# Altium schematic sheet 32x35雷达微动一体板V0.6.schdoc
size A3
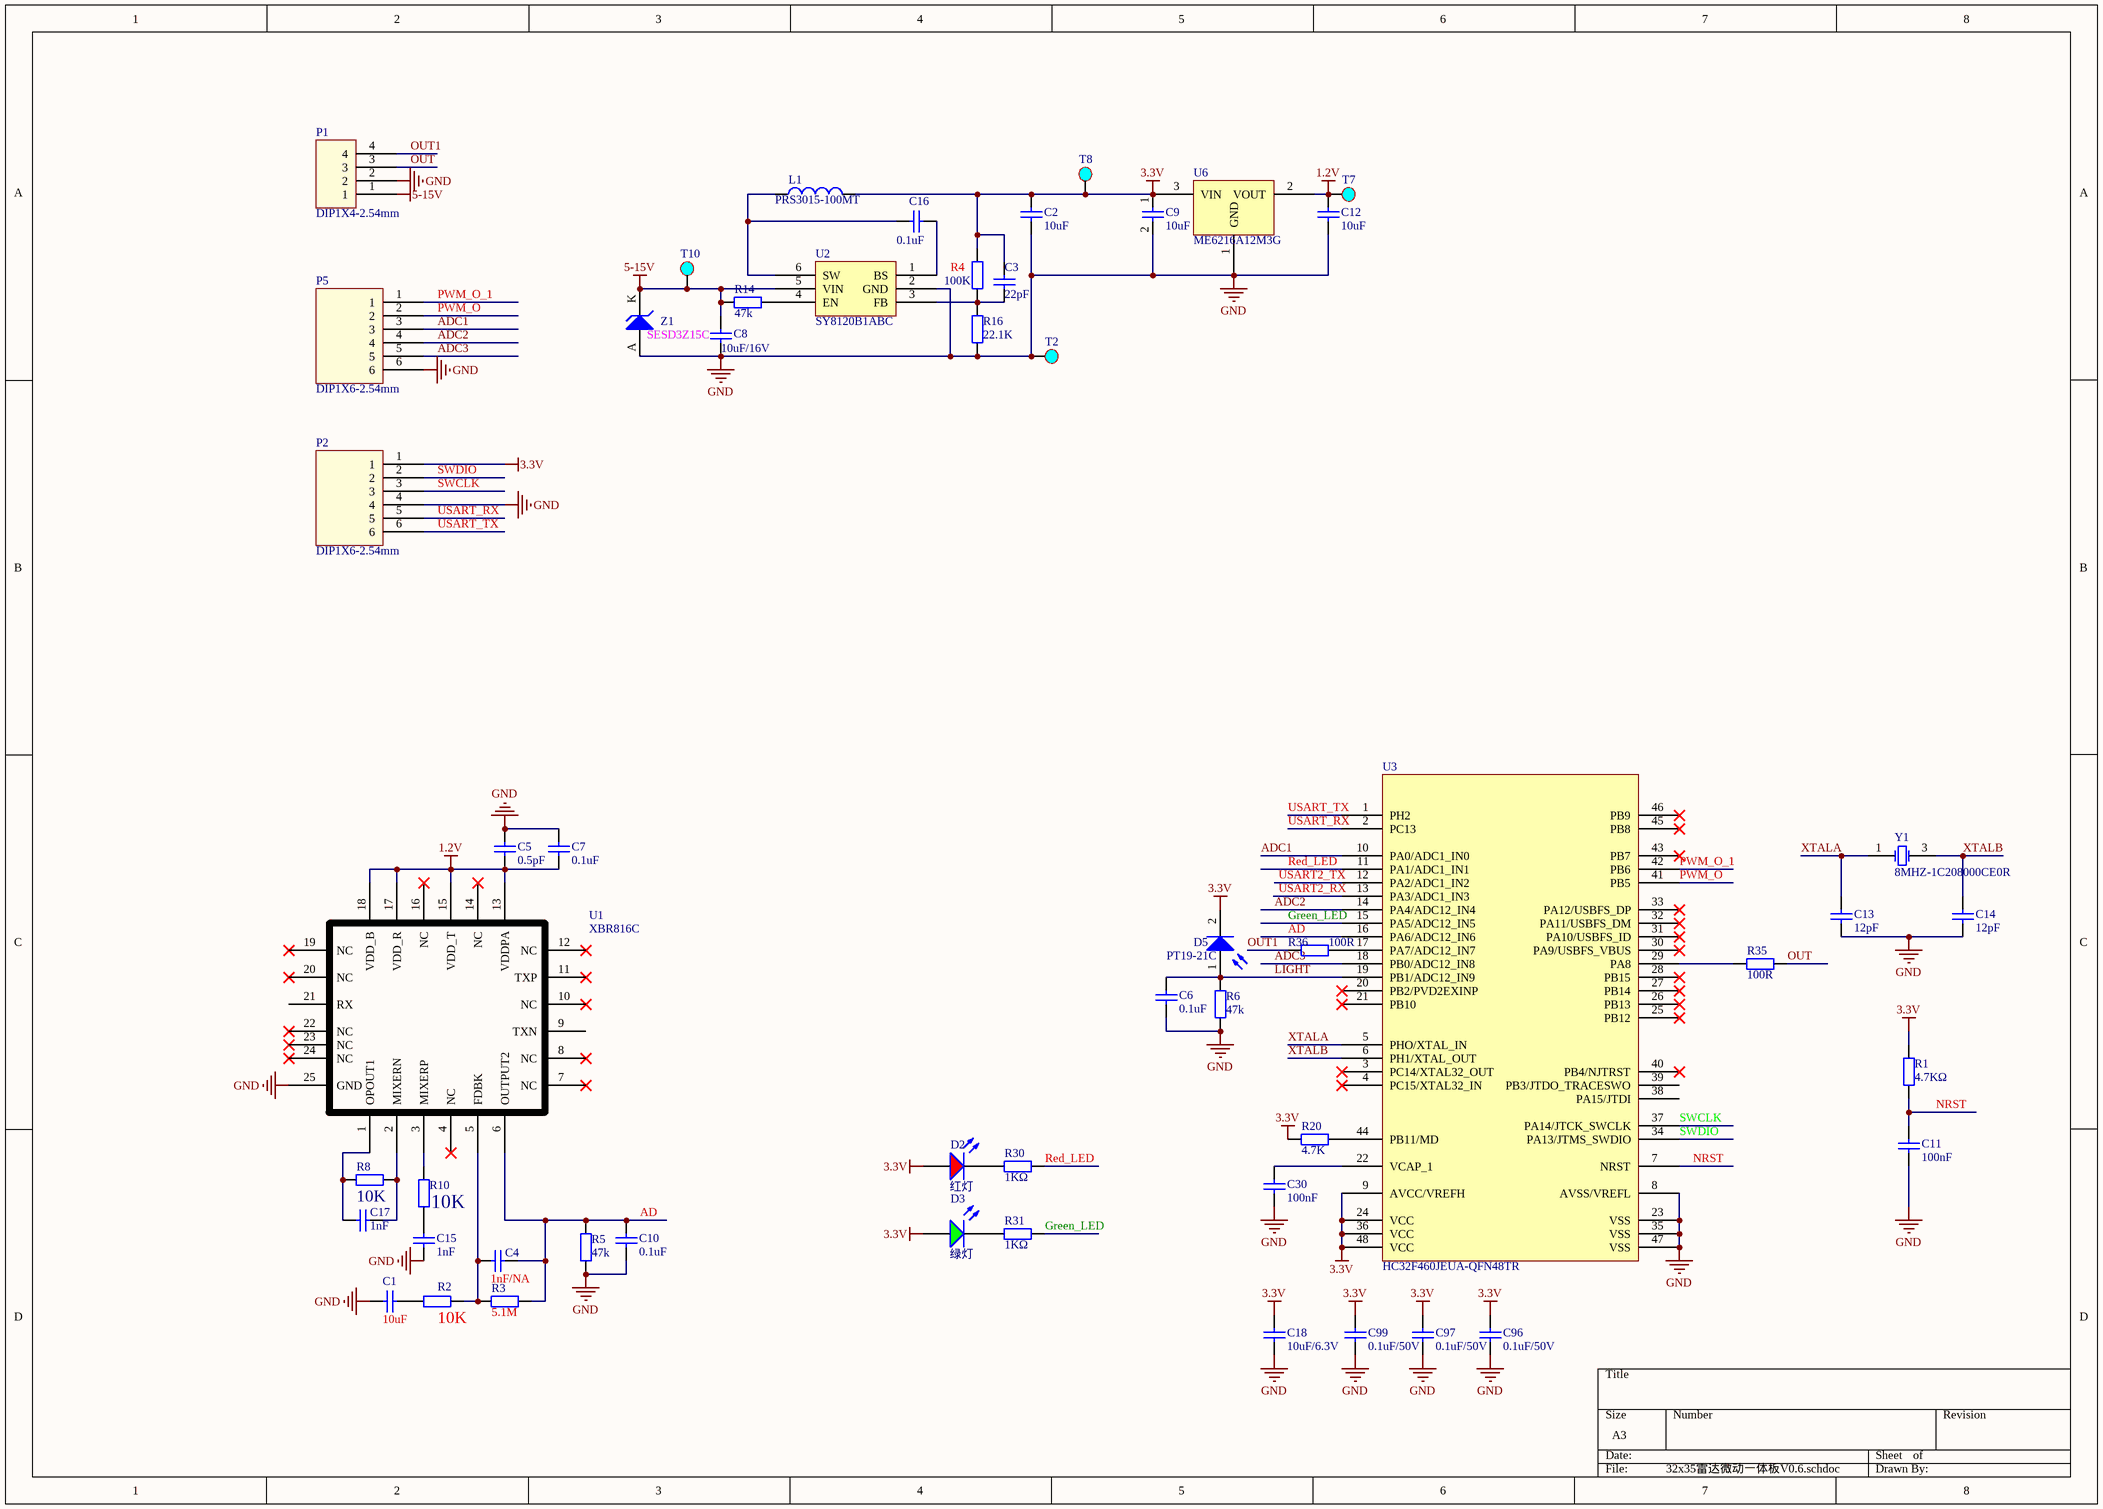
[diagram p0: 32x35雷达微动一体板V0.6.schdoc]

## Parts
C1  10uF  [C0402]
C2  10uF  [C0402]
C3  22pF  [C0402]
C4  1nF/NA  [C0402]
C5  0.5pF  [C0402]
C6  0.1uF  [C0402]
C7  0.1uF  [C0402]
C8  10uF/16V  [C0603]
C9  10uF  [C0402]
C10  0.1uF  [C0402]
C11  100nF  [C0402]
C12  10uF  [C0402]
C13  12pF  [C0402]
C14  12pF  [C0402]
C15  1nF  [C0402]
C16  0.1uF  [C0402]
C17  1nF  [C0402]
C18  10uF/6.3V  [C0402]
C30  100nF  [C0402]
C96  0.1uF/50V  [C0402]
C97  0.1uF/50V  [C0402]
C99  0.1uF/50V  [C0402]
D2  红灯  [LC-0603_LED_S1]
D3  绿灯  [LC-0603_LED_S1]
D5  PT19-21C  [LED-0603]
L1  PRS3015-100MT  [PRS3015]
P1  DIP1X4-2.54mm  [DIP1X4-2.54mm]
P2  DIP1X6-2.54mm  [DIP1X6-2.54]
P5  DIP1X6-2.54mm  [DIP1X6-2.54]
R1  4.7KΩ  [R0402]
R2  10K  [R0402]
R3  5.1M  [R0402]
R4  100K  [R0402]
R5  47k  [R0402]
R6  47k  [R0402]
R8  10K  [R0402]
R10  10K  [R0402]
R14  47k  [R0402]
R16  22.1K  [R0402]
R20  4.7K  [R0402]
R30  1KΩ  [R0402]
R31  1KΩ  [R0402]
R35  100R  [R0402]
R36  100R  [R0402]
T2  (no value)  [TestPoints]
T7  (no value)  [TestPoints]
T8  (no value)  [TestPoints]
T10  (no value)  [TestPoints]
U1  XBR816C  [XBR816]
U2  SY8120B1ABC  [SOT-23-6]
U3  HC32F460JEUA-QFN48TR  [QFN48-5X5mm]
U6  ME6216A12M3G  [SOT-23-L]
Y1  8MHZ-1C208000CE0R  [OSC-SMD_3225]
Z1  SESD3Z15C  [SOD323]

## Nets
1.2V: C5.1 C7.1 C12.1 T7.1 U1.13(VDDPA) U1.15(VDD_T) U1.17(VDD_R) U1.18(VDD_B) U6.2(VOUT)
3.3V: C2.1 C3.2 C9.1 C18.1 C96.1 C97.1 C99.1 D2.A D3.A D5.2(K) L1.2 P2.1 R1.2 R4.2 R20.1 T8.1 U3.9(AVCC/VREFH) U3.24(VCC) U3.36(VCC) U3.48(VCC) U6.3(VIN)
5-15V: C8.1 P1.1 R14.2 T10.1 U2.5(VIN) Z1.K
GND: C1.2 C2.2 C5.2 C6.2 C7.2 C8.2 C9.2 C10.2 C11.1 C12.2 C13.1 C14.1 C15.1 C18.2 C30.2 C96.2 C97.2 C99.2 P1.2 P2.4 P5.6 R5.2 R6.2 R16.1 T2.1 U1.25(GND) U2.2(GND) U3.8(AVSS/VREFL) U3.23(VSS) U3.35(VSS) U3.47(VSS) U6.1(GND) Z1.A
AD: C4.1 C10.1 R3.1 R5.1 U1.6(OUTPUT2) U3.16(PA6/ADC12_IN6)
ADC1: P5.3 U3.10(PA0/ADC1_IN0)
ADC2: P5.4 U3.14(PA4/ADC12_IN4)
ADC3: P5.5 U3.18(PB0/ADC12_IN8)
Green_LED: R31.1 U3.15(PA5/ADC12_IN5)
LIGHT: C6.1 D5.1(A) R6.1 U3.19(PB1/ADC12_IN9)
NRST: C11.2 R1.1 U3.7(NRST)
OUT: P1.3 R35.1
OUT1: P1.4 R36.2
PWM_O: P5.2 U3.41(PB5)
PWM_O_1: P5.1 U3.42(PB6)
Red_LED: R30.1 U3.11(PA1/ADC1_IN1)
SWCLK: P2.3 U3.37(PA14/JTCK_SWCLK)
SWDIO: P2.2 U3.34(PA13/JTMS_SWDIO)
USART2_RX: U3.13(PA3/ADC1_IN3)
USART2_TX: U3.12(PA2/ADC1_IN2)
USART_RX: P2.5 U3.2(PC13)
USART_TX: P2.6 U3.1(PH2)
XTALA: C13.2 U3.5(PHO/XTAL_IN) Y1.1(OSC1)
XTALB: C14.2 U3.6(PH1/XTAL_OUT) Y1.3(OSC2)
NetC1_1: C1.1 R2.1
NetC3_1: C3.1 R4.1 R16.2 U2.3(FB)
NetC4_2: C4.2 R2.2 R3.2 U1.5(FDBK)
NetC15_2: C15.2 R10.2
NetC16_1: C16.1 L1.1 U2.6(SW)
NetC16_2: C16.2 U2.1(BS)
NetC17_1: C17.1 R8.1 U1.2(MIXERN)
NetC17_2: C17.2 R8.2 U1.1(OPOUT1)
NetC30_1: C30.1 U3.22(VCAP_1)
NetD2_K: D2.K R30.2
NetD3_K: D3.K R31.2
NetR10_1: R10.1 U1.3(MIXERP)
NetR14_1: R14.1 U2.4(EN)
NetR20_2: R20.2 U3.44(PB11/MD)
NetR35_2: R35.2 U3.29(PA8)
NetR36_1: R36.1 U3.17(PA7/ADC12_IN7)

Not connected (* = marked no-connect by the designer): U1 4(NC)* 7(NC)* 8(NC)* 9(TXN) 10(NC)* 11(TXP)* 12(NC)* 14(NC)* 16(NC)* 19(NC)* 20(NC)* 21(RX) 22(NC)* 23(NC)* 24(NC)*; U3 3(PC14/XTAL32_OUT)* 4(PC15/XTAL32_IN)* 20(PB2/PVD2EXINP)* 21(PB10)* 25(PB12)* 26(PB13)* 27(PB14)* 28(PB15)* 30(PA9/USBFS_VBUS)* 31(PA10/USBFS_ID)* 32(PA11/USBFS_DM)* 33(PA12/USBFS_DP)* 38(PA15/JTDI) 39(PB3/JTDO_TRACESWO) 40(PB4/NJTRST)* 43(PB7)* 45(PB8)* 46(PB9)*

## Library data of the parts
C1-C10 C12 C15-C17 C30 = Cap: Capacitor; Published: 8-Jun-2000; LatestRevisionDate: 17-Jul-2002; LatestRevisionNote: Re-released for DXP Platform.; PackageReference: RAD-0.3; Publisher: Altium Limited; PackageDescription: Radial Cap, Thru-Hole; 2 Leads; 0.3 in Pin Spacing
  C1 C2 C9 C12: Value: 10uF
  C3: Value: 22pF
  C4: Value: 1nF/NA
  C5: Value: 0.5pF
  C6 C7 C10 C16: Value: 0.1uF
  C8: Value: 10uF/16V
  C15 C17: Value: 1nF
  C30: Value: 100nF
C11 = 0402 100nF (104) 10% 16V: 贴片电容; ComponentLink1Description: 供应商链接; ComponentLink1URL: http://www.szlcsc.com/product/details_1877.html; Package: 0402; Supplier: LC; SuppliersPartNumber: C1525
C13 C14 = 0402 22pF (220) 5% 50V: 贴片电容; ComponentLink1Description: 供应商链接; ComponentLink1URL: http://www.szlcsc.com/product/details_1907.html; Package: 0402; Supplier: LC; SuppliersPartNumber: C1555
C18 C96 C97 C99 = 0402 2.2nF (222) 10% 50V: 贴片电容; ComponentLink1Description: 供应商链接; ComponentLink1URL: http://www.szlcsc.com/product/details_1883.html; Package: 0402; Supplier: LC; SuppliersPartNumber: C1531
D2 D3 = 0603 红灯: 发光二极管; ComponentLink1Description: 供应商链接; ComponentLink1URL: http://www.szlcsc.com/product/details_2659.html; Package: 0603; Supplier: LC; SuppliersPartNumber: C2286
D5 = Photo Sen: Photosensitive Diode; Published: 24-Mar-1999; LatestRevisionDate: 17-Jul-2002; LatestRevisionNote: Re-released for DXP Platform.; PackageReference: PIN2; Publisher: Altium Limited; Value: PT19-21C
L1 = Inductor: Code_IEC: 1005; Published: 8-Jun-2000; LatestRevisionDate: 29-May-2009; LatestRevisionNote: IPC-7351 Footprint Added.; PackageReference: 0402-A; Publisher: Altium Limited; PackageDescription: Chip Inductor; Code_JEITA: 0402; Value: PRS3015-100MT
P1 = DIP4-2.54mm
R1 R35 R36 = 0402 4.7KΩ (4701) 1%: 贴片电阻; ComponentLink1Description: 供应商链接; ComponentLink1URL: http://www.szlcsc.com/product/details_26643.html; Package: 0402; Supplier: LC; SuppliersPartNumber: C25900
R2-R6 R8 R10 R14 R16 R20 = Res2: Resistor; Published: 8-Jun-2000; LatestRevisionDate: 17-Jul-2002; LatestRevisionNote: Re-released for DXP Platform.; PackageReference: AXIAL-0.4; Publisher: Altium Limited; PackageDescription: Axial Device, Thru-Hole; 2 Leads; 0.4 in Pin Spacing
  R2 R8 R10: Value: 10K
  R3: Value: 5.1M
  R4: Value: 100K
  R5 R6 R14: Value: 47k
  R16: Value: 22.1K
  R20: Value: 4.7K
R30 R31 = 0402 1KΩ (1001) 1%: 贴片电阻; ComponentLink1Description: 供应商链接; ComponentLink1URL: http://www.szlcsc.com/product/details_12256.html; Package: 0402; Supplier: LC; SuppliersPartNumber: C11702
T2 T7 T8 T10 = TestPoints
U1 = XBR1000_24_1
U2 = H9108
U3 = HC32F460JETA-LQFP48
U6 = SSP6206
Y1 = SMD-3225_4P  25MHZ 12PF 10PPM: 贴片晶振; ComponentLink1Description: 供应商链接; ComponentLink1URL: http://www.szlcsc.com/product/details_9526.html; Package: SMD-3225_4P; Supplier: LC; SuppliersPartNumber: C9006
Z1 = D Zener: Zener Diode; Published: 8-Jun-2000; LatestRevisionDate: 17-Jul-2002; LatestRevisionNote: Re-released for DXP Platform.; PackageReference: DIODE-0.7; Publisher: Altium Limited; PackageDescription: Diode, Thru-Hole; 2 Leads; 0.7 in Pin Spacing